# Altium schematic sheet ALIM_MOSFET 1.SchDoc
size A4; SheetNumber: 3; SheetTotal: 5
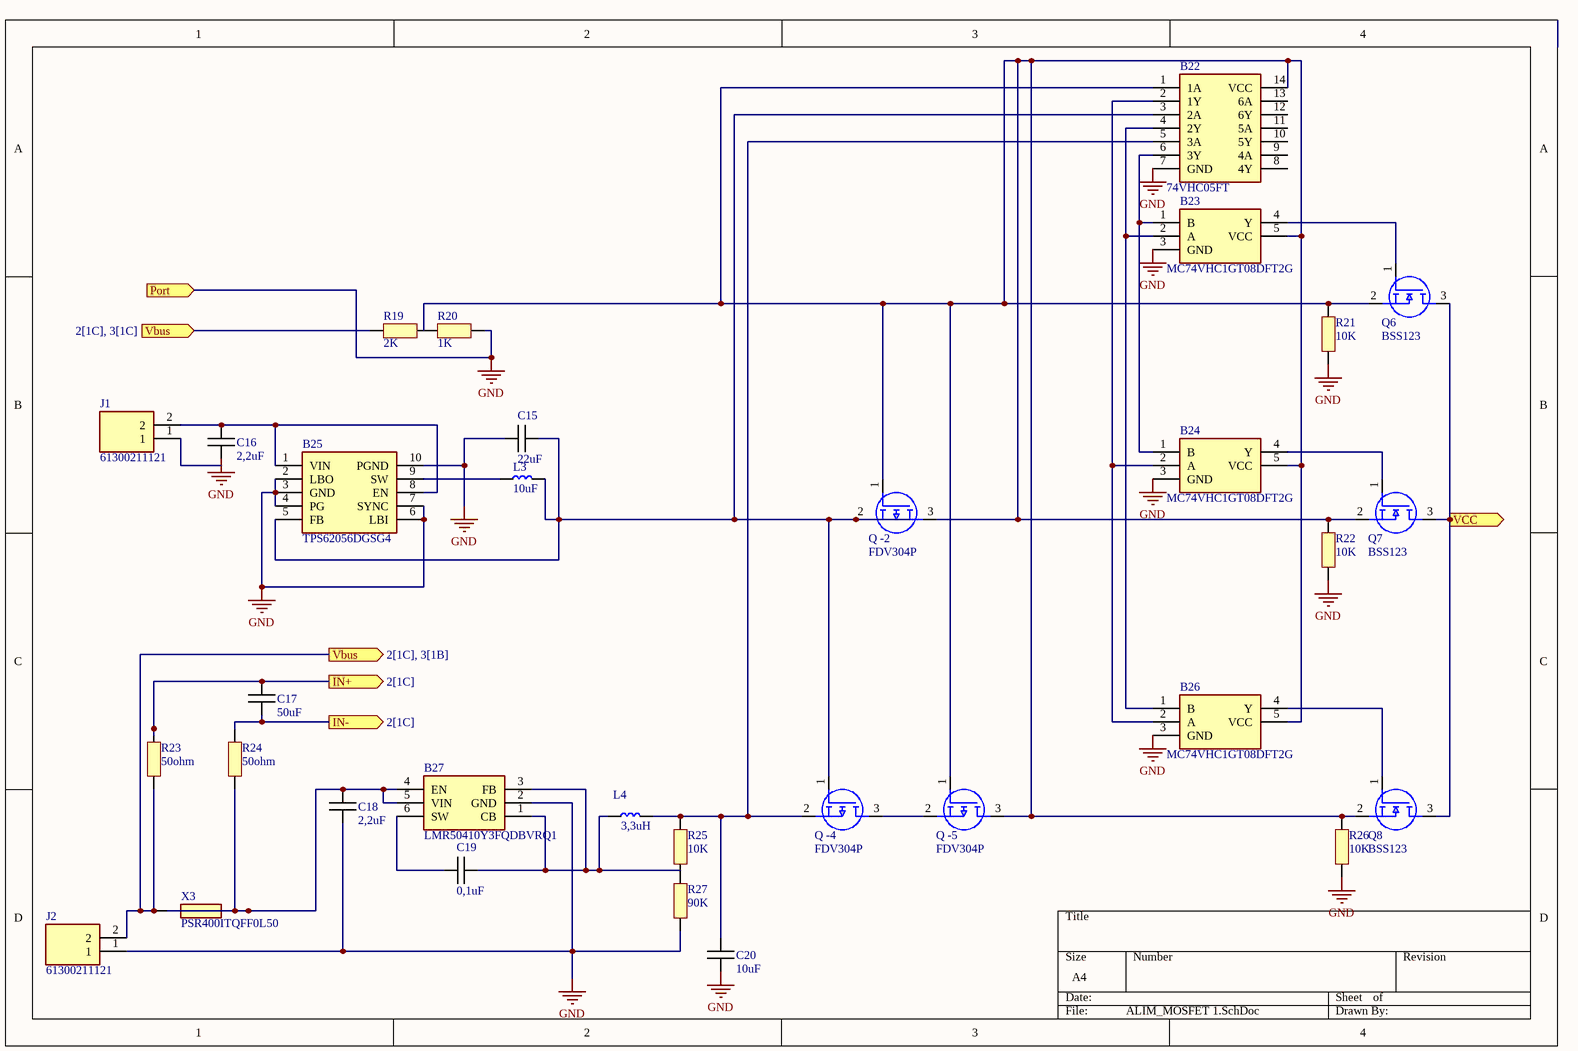
[diagram p0: ALIM_MOSFET 1.SchDoc]

## Parts
B22  74VHC05FT  [SOP65P640X120-14N]
B23  MC74VHC1GT08DFT2G  [SOT65P210X110-5N]
B24  MC74VHC1GT08DFT2G  [SOT65P210X110-5N]
B25  TPS62056DGSG4  [SOP50P490X110-10N]
B26  MC74VHC1GT08DFT2G  [SOT65P210X110-5N]
B27  LMR50410Y3FQDBVRQ1  [SOT95P280X145-6N]
C15  22uF  [CAPC1005X06N]
C16  2,2uF  [CAPC1005X06N]
C17  50uF  [CAPC1005X06N]
C18  2,2uF  [CAPC1005X06N]
C19  0,1uF  [CAPC1005X06N]
C20  10uF  [CAPC1005X06N]
J1  61300211121  [61300211121]
J2  61300211121  [61300211121]
L3  10uF  [LQPC1005X06N]
L4  3,3uH  [LQPC1005X06N]
Q6  BSS123  [BSS123]
Q7  BSS123  [BSS123]
Q8  BSS123  [BSS123]
Q_-2  FDV304P  [SOT95P251X112-3N]
Q_-4  FDV304P  [SOT95P251X112-3N]
Q_-5  FDV304P  [SOT95P251X112-3N]
R19  2K  [RESC1005X06N]
R20  1K  [RESC1005X06N]
R21  10K  [RESC1005X06N]
R22  10K  [RESC1005X06N]
R23  50ohm  [RESC1005X06N]
R24  50ohm  [RESC1005X06N]
R25  10K  [RESC1005X06N]
R26  10K  [RESC1005X06N]
R27  90K  [RESC1005X06N]
X3  PSR400ITQFF0L50  [RESC10052X200N]

## Ports
IN+ (out, see 2[1C]), IN- (out, see 2[1C]), Port (in), Vbus (in, see 2[1C], 3[1C]), Vbus (out, see 2[1C], 3[1B]), VCC (out)

## Nets
GND: B22.7(GND) B23.3(GND) B24.3(GND) B25.2(LBO) B25.3(GND) B25.4(PG) B25.6(LBI) B25.7(SYNC) B25.10(PGND) B26.3(GND) B27.2(GND) C15.2 C16.2 C18.2 C20.2 J2.1 R20.2 R21.2 R22.2 R26.2 R27.2 ; port Port
IN+: C17.1 R23.2 ; port IN+
IN-: C17.2 R24.2 ; port IN-
Vbus: J2.2 R19.1 R23.1 X3.1 ; port Vbus
VCC: Q6.3(D) Q7.3(D) Q8.3(D) ; port VCC
NetB22_1: B22.1(1A) B22.14(VCC) B23.5(VCC) B24.5(VCC) B26.5(VCC) Q6.2(S) Q7.2(S) Q8.2(S) Q_-2.1(G) Q_-2.3(D) Q_-5.1(G) Q_-5.3(D) R20.1 R21.1 R22.1 R26.1
NetB22_2: B22.2(1Y) B24.2(A) B26.2(A)
NetB22_3: B22.3(2A) B25.5(FB) C15.1 L3.2 Q_-2.2(S) Q_-4.1(G)
NetB22_4: B22.4(2Y) B23.2(A) B26.1(B)
NetB22_5: B22.5(3A) C20.1 L4.2 Q_-4.2(S) R25.1
NetB22_6: B22.6(3Y) B23.1(B) B24.1(B)
NetB23_4: B23.4(Y) Q6.1(G)
NetB24_4: B24.4(Y) Q7.1(G)
NetB25_1: B25.1(VIN) B25.8(EN) C16.1 J1.2
NetB25_9: B25.9(SW) L3.1
NetB26_4: B26.4(Y) Q8.1(G)
NetB27_1: B27.1(CB) B27.3(FB) C19.1 L4.1 R27.1
NetB27_4: B27.4(EN) B27.5(VIN) C18.1 R24.1 X3.2
NetB27_6: B27.6(SW) C19.2
NetQ_-4_3: Q_-4.3(D) Q_-5.2(S)

Not connected (* = marked no-connect by the designer): B22 8(4Y) 9(4A) 10(5Y) 11(5A) 12(6Y) 13(6A); J1 1; R19 2; R25 2

## Library data of the parts
B22 = 74VHC05FT: Logic Gates CMOS LOGIC IC INVERTER; Manufacturer_Name: Toshiba; Manufacturer_Part_Number: 74VHC05FT; Mouser Part Number: 757-74VHC05FT
B23 B24 B26 = MC74VHC1GT08DFT2G: Single 2-Input AND Gate, TTL Level; Manufacturer_Name: onsemi; Manufacturer_Part_Number: MC74VHC1GT08DFT2G; Parameter 3: *
B25 = TPS62056DGSG4: TEXAS INSTRUMENTS - TPS62056DGSG4 - Synchronous Buck (Step Down) Switching Regulator, Fixed, 2.7V-10Vin, 3.3V/0.8A out, 850kHz, VSSOP-10; Manufacturer_Name: Texas Instruments; Manufacturer_Part_Number: TPS62056DGSG4; Mouser Part Number: 595-TPS62056DGSG4
B27 = LMR50410Y3FQDBVRQ1: Régulateurs de tension de commutation Automotive qualified SIMPLE SWITCHER 4-V to 36-V, 1-A synchronous step-down converter 6-SOT-23 -40 to 150; Manufacturer_Name: Texas Instruments; Manufacturer_Part_Number: LMR50410Y3FQDBVRQ1; Mouser Part Number: 595-R50410Y3FQDBVRQ1
C15-C20 = Capacitor
J1 J2 = 61300211121: WURTH ELEKTRONIK - 61300211121 - HEADER, 2.54MM, PIN, THT, VERTICAL, 2WAY
L3 L4 = Bobine
Q6-Q8 = BSS123: BSS123 N-Channel MOSFET, 170 mA, 100 V PowerTrench, 3-Pin SOT-23 ON Semiconductor
Q_-2 Q_-4 Q_-5 = FDV304P: ON SEMICONDUCTOR - FDV304P - Power MOSFET, P Channel, 25 V, 460 mA, 1.22 ohm, SOT-23, Surface Mount; Manufacturer_Name: onsemi; Geometry.Height: 1.12mm; Manufacturer_Part_Number: FDV304P; Mouser Part Number: 512-FDV304P; Mouser Price/Stock: https://www.mouser.co.uk/ProductDetail/onsemi-Fairchild/FDV304P?qs=FOlmdCx%252BAA1BAlCQZu888w%3D%3D; Arrow Part Number: FDV304P; Arrow Price/Stock: https://www.arrow.com/en/products/fdv304p/on-semiconductor?utm_currency=USD&region=europe; Datasheet Link: https://componentsearchengine.com/Datasheets/2/FDV304P.pdf
R19-R27 = Resistor
X3 = PSR400ITQFF0L50: ROHM - PSR400ITQFF0L50 - SMD Current Sense Resistor, 500 ohm, PSR Series, 3921 [1052 Metric], 4 W, +/- 1%, Metal Strip; Manufacturer_Name: ROHM Semiconductor; Geometry.Height: 2mm; Manufacturer_Part_Number: PSR400ITQFF0L50; Mouser Part Number: 755-PSR400ITQFF0L50; Mouser Price/Stock: https://www.mouser.co.uk/ProductDetail/ROHM-Semiconductor/PSR400ITQFF0L50?qs=493kPxzlxfLaT1w5Mo%252BtHg%3D%3D; Arrow Part Number: *; Arrow Price/Stock: *; Datasheet Link: https://componentsearchengine.com/Datasheets/2/PSR400ITQFF0L50.pdf